# Altium schematic sheet Back_EMF.SchDoc
size A4; Organization: Altium Limited; Address1: L3, 12a Rodborough Rd; Address2: Frenchs Forest; Address3: NSW; Address4: Australia 2086
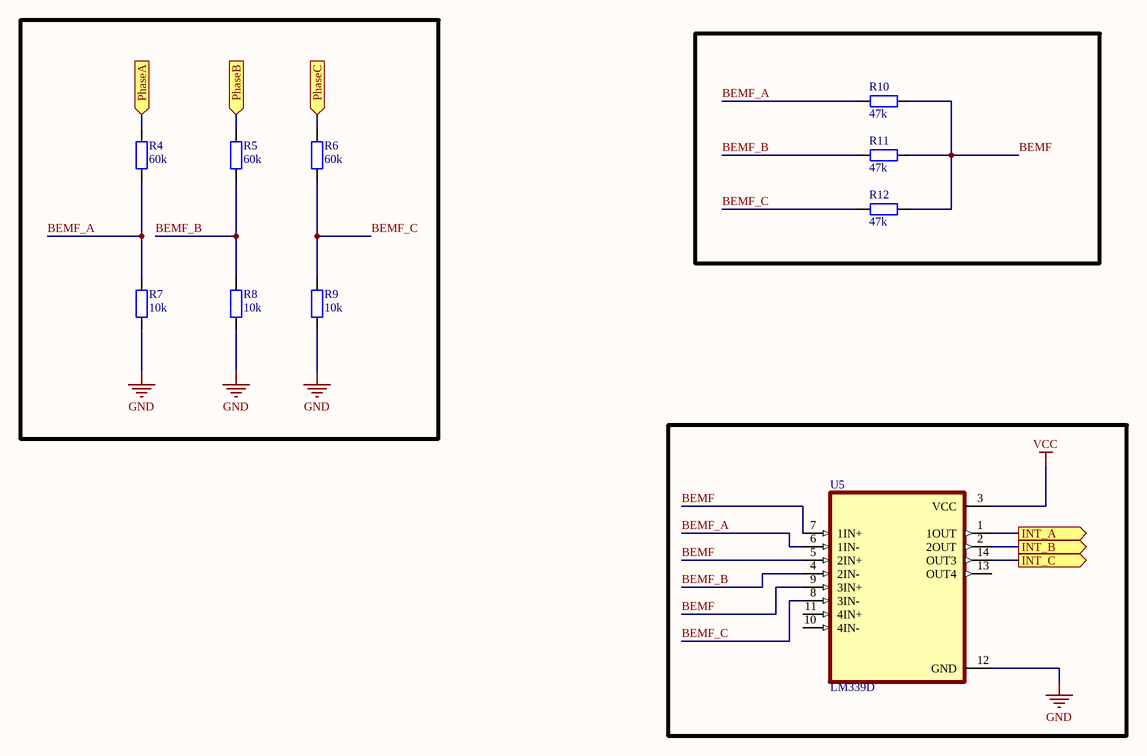
[diagram p0: Back_EMF.SchDoc]

## Parts
R4  60k  [tro smd 0603]
R5  60k  [tro smd 0603]
R6  60k  [tro smd 0603]
R7  10k  [tro smd 0603]
R8  10k  [tro smd 0603]
R9  10k  [tro smd 0603]
R10  47k  [tro smd 0603]
R11  47k  [tro smd 0603]
R12  47k  [tro smd 0603]
U5  LM339D  [SOIC127P600X175-14N]

## Ports
INT_A (out), INT_B (out), INT_C (out), PhaseA (in), PhaseB (in), PhaseC (in)

## Nets
GND: R7.1 R8.1 R9.1 U5.12(GND)
VCC: U5.3(VCC)
BEMF: R10.2 R11.2 R12.2 U5.5(2IN+) U5.7(1IN+) U5.9(3IN+)
BEMF_A: R4.1 R7.2 R10.1 U5.6(1IN-)
BEMF_B: R5.1 R8.2 R11.1 U5.4(2IN-)
BEMF_C: R6.1 R9.2 R12.1 U5.8(3IN-)
INT_A: U5.1(1OUT) ; port INT_A
INT_B: U5.2(2OUT) ; port INT_B
INT_C: U5.14(OUT3) ; port INT_C
PhaseA: R4.2 ; port PhaseA
PhaseB: R5.2 ; port PhaseB
PhaseC: R6.2 ; port PhaseC

Not connected (* = marked no-connect by the designer): U5 10(4IN-) 11(4IN+) 13(OUT4)

## Notes on the sheet
- Title
- Size:
- Date:
- A4
- Number:
- Time:
- Revision:
- Sheet
- of
- File:

## Library data of the parts
R4-R9 = Tro 0603 1% 10k: Dán; Don_Vi: Con; So_Chan: 2; Ten_Linh_Kien: Trở 0603 1% 10k; Ma_Hang: MH006333; Chung_Loai: Dán; Kieu_Chan: *
R10-R12 = Tro 0603 5% 47k: Dán; Chung_loai: Dám; Don_Vi: Con; So_Chan: 2; Ten_Linh_Kien: Trở 0603 5% 47k; Ma_Hang: MH007665; Kieu_Chan: *
U5 = LM339D: Price: None; Value: *; Package: None; Availability: Unavailable; MP: LM339D